# Altium schematic sheet 02_4G模块测试板原理图.SchDoc
size A4
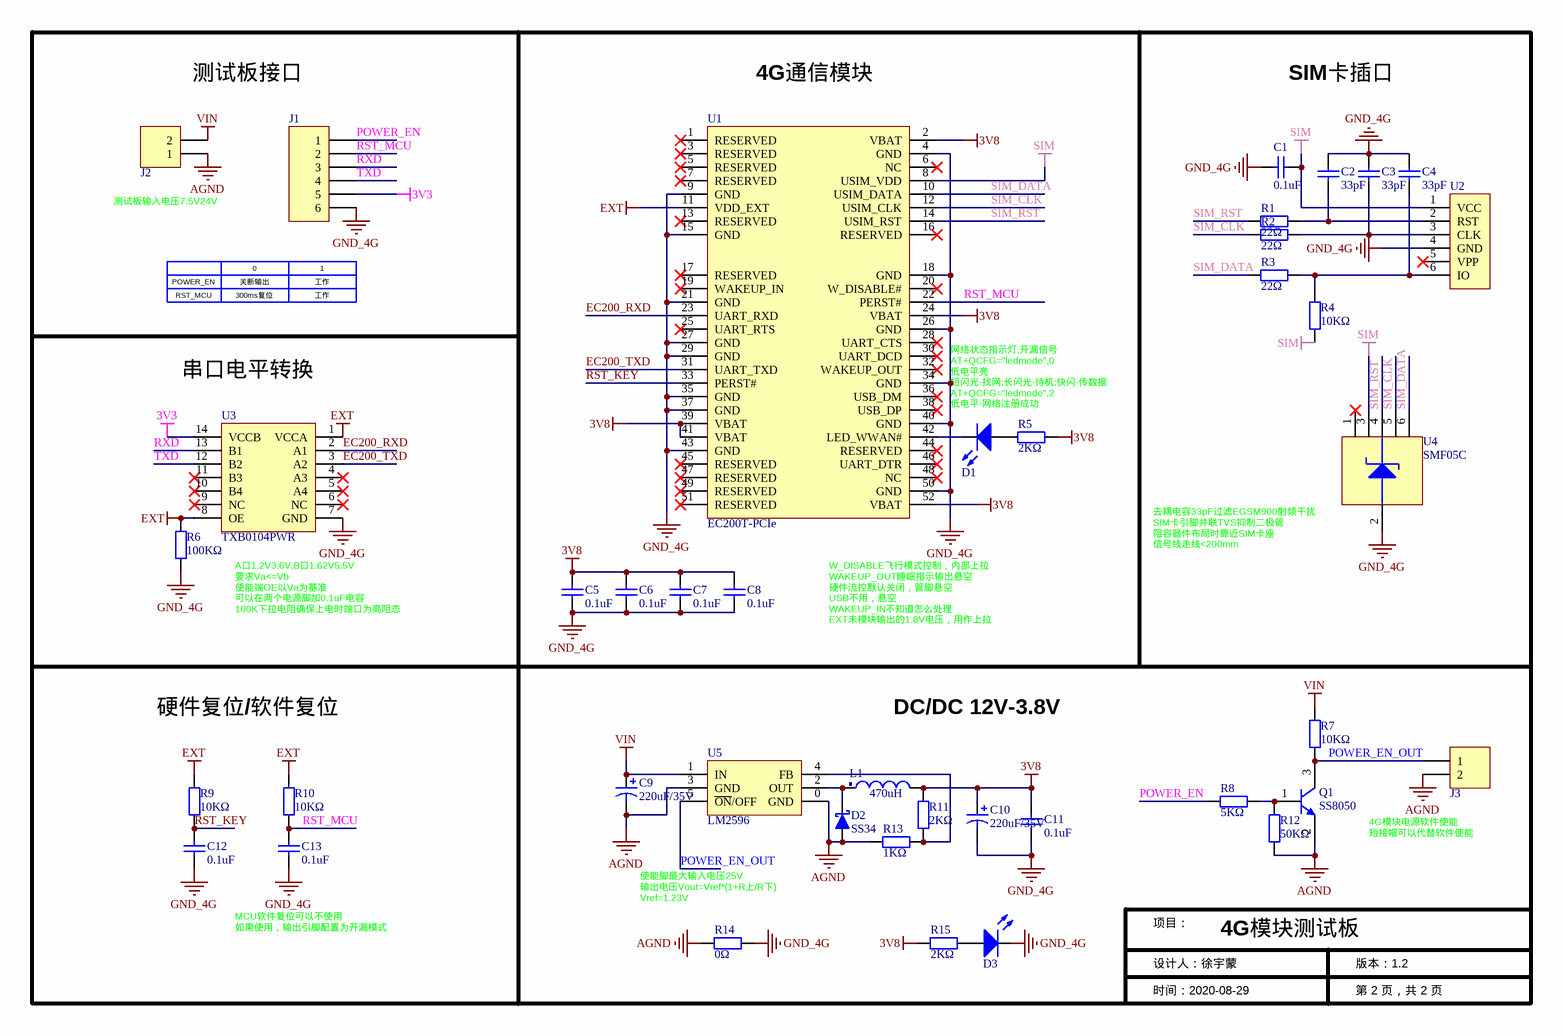
[diagram p0: 02_4G模块测试板原理图.SchDoc]

## Parts
C1  value 0.1uF  [CAP-0603]  (hidden comment: Cap)
C2  value 33pF  [CAP-0603]  (hidden comment: Cap)
C3  value 33pF  [CAP-0603]  (hidden comment: Cap)
C4  value 33pF  [CAP-0603]  (hidden comment: Cap)
C5  value 0.1uF  [CAP-0603]  (hidden comment: Cap)
C6  value 0.1uF  [CAP-0603]  (hidden comment: Cap)
C7  value 0.1uF  [CAP-0603]  (hidden comment: Cap)
C8  value 0.1uF  [CAP-0603]  (hidden comment: Cap)
C9  value 220uF/35V  [Cap8x10.5mm]  (hidden comment: Cap Pol)
C10  value 220uF/35V  [Cap8x10.5mm]  (hidden comment: Cap Pol)
C11  value 0.1uF  [CAP-0603]  (hidden comment: Cap)
C12  value 0.1uF  [CAP-0603]  (hidden comment: Cap)
C13  value 0.1uF  [CAP-0603]  (hidden comment: Cap)
D1  LED  [LED_0805]  (value not drawn)
D2  SS34  [SMA(DO-214AC)]
D3  LED  [LED_0805]  (value not drawn)
J1  Header6  [Header_6x1_2.54_排针]  (value not drawn)
J2  Header 2  [Header_HT_2P_5.08_Right]  (value not drawn)
J3  Header 2  [Header_2X1_2.54]  (value not drawn)
L1  value 470uH  [CD43]  (hidden comment: Inductor)
Q1  SS8050  [SOT-23]
R1  value 22Ω  [0603]  (hidden comment: Res)
R2  value 22Ω  [0603]  (hidden comment: Res)
R3  value 22Ω  [0603]  (hidden comment: Res)
R4  value 10KΩ  [0603]  (hidden comment: Res)
R5  value 2KΩ  [0603]  (hidden comment: Res)
R6  value 100KΩ  [0603]  (hidden comment: Res)
R7  value 10KΩ  [0603]  (hidden comment: Res)
R8  value 5KΩ  [0603]  (hidden comment: Res)
R9  value 10KΩ  [0603]  (hidden comment: Res)
R10  value 10KΩ  [0603]  (hidden comment: Res)
R11  value 2KΩ  [0603]  (hidden comment: Res)
R12  value 50KΩ  [0603]  (hidden comment: Res)
R13  value 1KΩ  [0603]  (hidden comment: Res)
R14  value 0Ω  [0805]  (hidden comment: Res)
R15  value 2KΩ  [0603]  (hidden comment: Res)
U1  EC200T-PCIe  [miniPCIe1]
U2  nano_sim  [Nano_SIM_6P]  (value not drawn)
U3  TXB0104PWR  [TSSOP-14]
U4  SMF05C  [SOT-363]
U5  LM2596  [TO-263-5 无背面散热]

## Nets
3V3: J1.5 U3.14(VCCB)
3V8: C5.2 C6.2 C7.2 C8.2 C10.1 C11.2 L1.2 R5.1 R11.1 R15.2 U1.2(VBAT) U1.24(VBAT) U1.39(VBAT) U1.41(VBAT) U1.52(VBAT)
AGND: C9.2 D2.1(A) J2.1 J3.2 Q1.2(E) R12.2 R13.1 R14.1 U5.0(GND) U5.3(GND)
EXT: R6.2 R9.2 R10.1 U1.11(VDD_EXT) U3.1(VCCA) U3.8(OE)
GND_4G: C1.2 C2.1 C3.1 C4.2 C5.1 C6.1 C7.1 C8.1 C10.2 C11.1 C12.1 C13.2 D3.2(K) J1.6 R6.1 R14.2 U1.4(GND) U1.9(GND) U1.15(GND) U1.18(GND) U1.21(GND) U1.26(GND) U1.27(GND) U1.29(GND) U1.34(GND) U1.35(GND) U1.37(GND) U1.40(GND) U1.43(GND) U1.50(GND) U2.4(GND) U3.7(GND) U4.2(gnd)
SIM: C1.1 R4.2 U1.8(USIM_VDD) U2.1(VCC) U4.3(gnd)
VIN: C9.1 J2.2 R7.1 U5.1(IN)
EC200_RXD: U1.23(UART_RXD) U3.2(A1)
EC200_TXD: U1.31(UART_TXD) U3.3(A2)
POWER_EN: J1.1 R8.1
POWER_EN_OUT: J3.1 Q1.3(C) R7.2 U5.5(~{ON}/OFF)
RST_KEY: C12.2 R9.1 U1.33(PERST#)
RST_MCU: C13.1 J1.2 R10.2 U1.22(PERST#)
RXD: J1.3 U3.13(B1)
SIM_CLK: R2.1 U1.12(USIM_CLK) U4.5(gnd)
SIM_DATA: R3.1 U1.10(USIM_DATA) U4.6(gnd)
SIM_RST: R1.1 U1.14(USIM_RST) U4.4(gnd)
TXD: J1.4 U3.12(B2)
NetC2_2: C2.2 R1.2 U2.2(RST)
NetC3_2: C3.2 R2.2 U2.3(CLK)
NetC4_1: C4.1 R3.2 R4.1 U2.6(IO)
NetD1_1: D1.1(A) R5.2
NetD1_2: D1.2(K) U1.42(LED_WWAN#)
NetD2_2: D2.2(K) L1.1 U5.2(OUT)
NetD3_1: D3.1(A) R15.1
NetQ1_1: Q1.1(B) R8.2 R12.1
NetR11_2: R11.2 R13.2 U5.4(FB)

Not connected (* = marked no-connect by the designer): U1 1(RESERVED)* 3(RESERVED)* 5(RESERVED)* 6(NC)* 7(RESERVED)* 13(RESERVED)* 16(RESERVED)* 17(RESERVED)* 19(WAKEUP_IN)* 20(W_DISABLE#)* 25(UART_RTS)* 28(UART_CTS)* 30(UART_DCD)* 32(WAKEUP_OUT)* 36(USB_DM)* 38(USB_DP)* 44(RESERVED)* 45(RESERVED)* 46(UART_DTR)* 47(RESERVED)* 48(NC)* 49(RESERVED)* 51(RESERVED)*; U2 5(VPP)*; U3 4(A3)* 5(A4)* 6(NC)* 9(NC)* 10(B4)* 11(B3)*; U4 1(gnd)*

## Notes on the sheet
- 测试板接口
- 4G通信模块
- SIM卡插口
- (near J2) 测试板输入电压7.5V24V
- POWER_EN
- RST_MCU
- 0
- 关断输出
- 300ms复位
- 1
- 工作
- 串口电平转换
- 网络状态指示灯,开漏信号
  AT+QCFG="ledmode",0
  低电平亮
  短闪光-找网;长闪光-待机;快闪-传数据
  AT+QCFG="ledmode",2
  低电平-网络注册成功
- (near U4) 去耦电容33pF过滤EGSM900射频干扰
  SIM卡引脚并联TVS抑制二极管
  阻容器件布局时靠近SIM卡座
  信号线走线<200mm
- A口1.2V3.6V,B口1.62V5.5V
  要求Va<=Vb
  使能端OE以Va为基准
  可以在两个电源脚加0.1uF电容
  100K下拉电阻确保上电时端口为高阻态
- W_DISABLE飞行模式控制，内部上拉
  WAKEUP_OUT睡眠指示输出悬空
  硬件流控默认关闭，管脚悬空
  USB不用，悬空
  WAKEUP_IN不知道怎么处理
  EXT未模块输出的1.8V电压，用作上拉
- 硬件复位/软件复位
- DC/DC 12V-3.8V
- 4G模块电源软件使能
  短接帽可以代替软件使能
- (near R14) 使能脚最大输入电压25V
  输出电压Vout=Vref*(1+R上/R下)
  Vref=1.23V
- 项目：
- 4G模块测试板
- MCU软件复位可以不使用
  如果使用，输出引脚配置为开漏模式
- 设计人：徐宇蒙
- 时间：2020-08-29
- 第 2 页，共 2 页
- 版本：1.2

## Library data of the parts
C1-C8 C11-C13 = Cap: 无极性电容; Published: 8-Jun-2000; LatestRevisionDate: 17-Jul-2002; LatestRevisionNote: Re-released for DXP Platform.; PackageReference: RAD-0.3; Publisher: Altium Limited
C9 C10 = Cap Pol: 贴片电解电容 8*10.5mm; Published: 8-Jun-2000; LatestRevisionDate: 17-Jul-2002; LatestRevisionNote: Re-released for DXP Platform.; PackageReference: POLAR0.8; Publisher: Altium Limited
D1 D3 = LED: 发光二极管; Published: 8-Jun-2000; LatestRevisionDate: 08-Jul-2005; LatestRevisionNote: Mech Layer 1 removed.; PackageReference: LED-0; Publisher: Altium Limited
D2 = D Schottky: Schottky Diode; Published: 8-Jun-2000; LatestRevisionDate: 17-Jul-2002; LatestRevisionNote: Re-released for DXP Platform.; PackageReference: SMB; Publisher: Altium Limited; Code_JEDEC: DO-214-AA
J1 = Header6: 接插件
J2 J3 = Header 2: 接插件; LatestRevisionDate: 17-Jul-2002; LatestRevisionNote: Re-released for DXP Platform.; Publisher: Altium Limited
L1 = Inductor: 贴片功率电感; Code_IEC: 1005; Published: 8-Jun-2000; LatestRevisionDate: 17-Jul-2002; LatestRevisionNote: Re-released for DXP Platform.; PackageReference: 0402-A; Publisher: Altium Limited; Code_JEITA: 0402
Q1 = SS8050: NPN贴片三极管; Published: 8-Jun-2000; LatestRevisionDate: 15-Jan-2003; LatestRevisionNote: PCB Footprint 'BCY-W3/D4.7' replaced; DatasheetDocument: 1997; PackageDocument: Sep-1998; PackageReference: TO-92A; Publisher: Altium Limited; Code_JEDEC: TO-92A; ComponentLink1Description: Manufacturer Link; ComponentLink1URL: http://www.fairchildsemi.com/; ComponentLink2Description: Datasheet; ComponentLink2URL: http://www.fairchildsemi.com/ds/2N%2F2N3904.pdf
R1-R15 = Res: 贴片电阻; Published: 8-Jun-2000; LatestRevisionDate: 17-Jul-2002; LatestRevisionNote: Re-released for DXP Platform.; PackageReference: AXIAL-0.4; Publisher: Altium Limited
U3 = TXB0104PWR: 电平转换芯片
U5 = LM2596: DC/DC